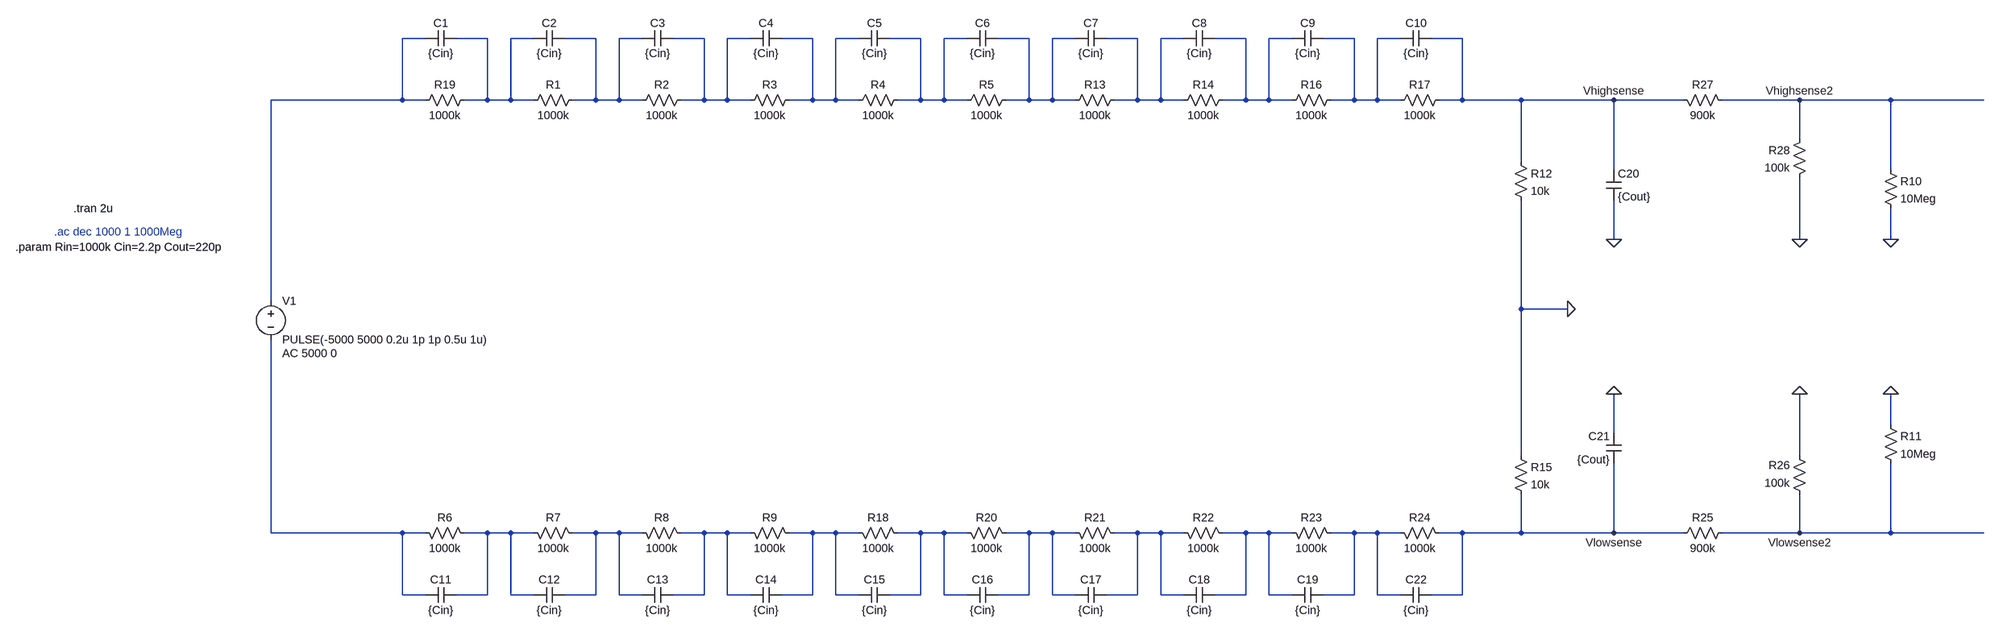
[diagram p0: schematic HVPSim.asc]
HVPSim.asc, the LTspice schematic file:
Version 4
SHEET 1 1996 816
WIRE -1616 -448 -1664 -448
WIRE -1488 -448 -1552 -448
WIRE -1392 -448 -1440 -448
WIRE -1264 -448 -1328 -448
WIRE -1168 -448 -1216 -448
WIRE -1040 -448 -1104 -448
WIRE -944 -448 -992 -448
WIRE -816 -448 -880 -448
WIRE -720 -448 -768 -448
WIRE -592 -448 -656 -448
WIRE -496 -448 -544 -448
WIRE -368 -448 -432 -448
WIRE -272 -448 -320 -448
WIRE -144 -448 -208 -448
WIRE -48 -448 -96 -448
WIRE 80 -448 16 -448
WIRE 176 -448 128 -448
WIRE 304 -448 240 -448
WIRE 400 -448 352 -448
WIRE 528 -448 464 -448
WIRE -1664 -320 -1664 -448
WIRE -1664 -320 -1936 -320
WIRE -1616 -320 -1664 -320
WIRE -1488 -320 -1488 -448
WIRE -1488 -320 -1536 -320
WIRE -1440 -320 -1440 -448
WIRE -1440 -320 -1488 -320
WIRE -1392 -320 -1440 -320
WIRE -1264 -320 -1264 -448
WIRE -1264 -320 -1312 -320
WIRE -1216 -320 -1216 -448
WIRE -1216 -320 -1264 -320
WIRE -1168 -320 -1216 -320
WIRE -1040 -320 -1040 -448
WIRE -1040 -320 -1088 -320
WIRE -992 -320 -992 -448
WIRE -992 -320 -1040 -320
WIRE -944 -320 -992 -320
WIRE -816 -320 -816 -448
WIRE -816 -320 -864 -320
WIRE -768 -320 -768 -448
WIRE -768 -320 -816 -320
WIRE -720 -320 -768 -320
WIRE -592 -320 -592 -448
WIRE -592 -320 -640 -320
WIRE -544 -320 -544 -448
WIRE -544 -320 -592 -320
WIRE -496 -320 -544 -320
WIRE -368 -320 -368 -448
WIRE -368 -320 -416 -320
WIRE -320 -320 -320 -448
WIRE -320 -320 -368 -320
WIRE -272 -320 -320 -320
WIRE -144 -320 -144 -448
WIRE -144 -320 -192 -320
WIRE -96 -320 -96 -448
WIRE -96 -320 -144 -320
WIRE -48 -320 -96 -320
WIRE 80 -320 80 -448
WIRE 80 -320 32 -320
WIRE 128 -320 128 -448
WIRE 128 -320 80 -320
WIRE 176 -320 128 -320
WIRE 304 -320 304 -448
WIRE 304 -320 256 -320
WIRE 352 -320 352 -448
WIRE 352 -320 304 -320
WIRE 400 -320 352 -320
WIRE 528 -320 528 -448
WIRE 528 -320 480 -320
WIRE 864 -320 528 -320
WIRE 1056 -320 864 -320
WIRE 1200 -320 1056 -320
WIRE 1440 -320 1280 -320
WIRE 1712 -320 1440 -320
WIRE 1904 -320 1712 -320
WIRE 1440 -240 1440 -320
WIRE 864 -192 864 -320
WIRE 1056 -176 1056 -320
WIRE 1712 -176 1712 -320
WIRE 1056 -32 1056 -112
WIRE 1440 -32 1440 -160
WIRE 1712 -32 1712 -96
WIRE -1936 96 -1936 -320
WIRE 864 112 864 -112
WIRE 960 112 864 112
WIRE 1712 352 1712 288
WIRE 1056 368 1056 288
WIRE 864 416 864 112
WIRE 1440 416 1440 288
WIRE -1936 576 -1936 176
WIRE -1664 576 -1936 576
WIRE -1616 576 -1664 576
WIRE -1488 576 -1536 576
WIRE -1440 576 -1488 576
WIRE -1392 576 -1440 576
WIRE -1264 576 -1312 576
WIRE -1216 576 -1264 576
WIRE -1168 576 -1216 576
WIRE -1040 576 -1088 576
WIRE -992 576 -1040 576
WIRE -944 576 -992 576
WIRE -816 576 -864 576
WIRE -768 576 -816 576
WIRE -720 576 -768 576
WIRE -592 576 -640 576
WIRE -544 576 -592 576
WIRE -496 576 -544 576
WIRE -368 576 -416 576
WIRE -320 576 -368 576
WIRE -272 576 -320 576
WIRE -144 576 -192 576
WIRE -96 576 -144 576
WIRE -48 576 -96 576
WIRE 80 576 32 576
WIRE 128 576 80 576
WIRE 176 576 128 576
WIRE 304 576 256 576
WIRE 352 576 304 576
WIRE 400 576 352 576
WIRE 528 576 480 576
WIRE 864 576 864 496
WIRE 864 576 528 576
WIRE 1056 576 1056 432
WIRE 1056 576 864 576
WIRE 1200 576 1056 576
WIRE 1440 576 1440 496
WIRE 1440 576 1280 576
WIRE 1712 576 1712 432
WIRE 1712 576 1440 576
WIRE 1904 576 1712 576
WIRE -1664 704 -1664 576
WIRE -1616 704 -1664 704
WIRE -1488 704 -1488 576
WIRE -1488 704 -1552 704
WIRE -1440 704 -1440 576
WIRE -1392 704 -1440 704
WIRE -1264 704 -1264 576
WIRE -1264 704 -1328 704
WIRE -1216 704 -1216 576
WIRE -1168 704 -1216 704
WIRE -1040 704 -1040 576
WIRE -1040 704 -1104 704
WIRE -992 704 -992 576
WIRE -944 704 -992 704
WIRE -816 704 -816 576
WIRE -816 704 -880 704
WIRE -768 704 -768 576
WIRE -720 704 -768 704
WIRE -592 704 -592 576
WIRE -592 704 -656 704
WIRE -544 704 -544 576
WIRE -496 704 -544 704
WIRE -368 704 -368 576
WIRE -368 704 -432 704
WIRE -320 704 -320 576
WIRE -272 704 -320 704
WIRE -144 704 -144 576
WIRE -144 704 -208 704
WIRE -96 704 -96 576
WIRE -48 704 -96 704
WIRE 80 704 80 576
WIRE 80 704 16 704
WIRE 128 704 128 576
WIRE 176 704 128 704
WIRE 304 704 304 576
WIRE 304 704 240 704
WIRE 352 704 352 576
WIRE 400 704 352 704
WIRE 528 704 528 576
WIRE 528 704 464 704
FLAG 1712 -32 0
FLAG 1712 288 0
FLAG 960 112 0
FLAG 1056 -320 Vhighsense
FLAG 1056 -32 0
FLAG 1056 288 0
FLAG 1056 576 Vlowsense
FLAG 1440 288 0
FLAG 1440 -32 0
FLAG 1440 -320 Vhighsense2
FLAG 1440 576 Vlowsense2
SYMBOL voltage -1936 80 R0
WINDOW 123 24 124 Left 2
WINDOW 39 0 0 Left 0
SYMATTR Value2 AC 5000 0
SYMATTR InstName V1
SYMATTR Value PULSE(-5000 5000 0.2u 1p 1p 0.5u 1u)
SYMBOL res 1696 -192 R0
SYMATTR InstName R10
SYMATTR Value 10Meg
SYMBOL res 1696 336 R0
SYMATTR InstName R11
SYMATTR Value 10Meg
SYMBOL res 848 -208 R0
SYMATTR InstName R12
SYMATTR Value 10k
SYMBOL res 848 400 R0
SYMATTR InstName R15
SYMATTR Value 10k
SYMBOL res -1520 -336 R90
WINDOW 0 0 56 VBottom 2
WINDOW 3 32 56 VTop 2
SYMATTR InstName R19
SYMATTR Value 1000k
SYMBOL cap 1040 -176 R0
SYMATTR InstName C20
SYMATTR Value {Cout}
SYMBOL cap 1072 432 R180
WINDOW 0 24 56 Left 2
WINDOW 3 24 8 Left 2
SYMATTR InstName C21
SYMATTR Value {Cout}
SYMBOL cap -1552 -464 R90
WINDOW 0 0 32 VBottom 2
WINDOW 3 32 32 VTop 2
SYMATTR InstName C1
SYMATTR Value {Cin}
SYMBOL res -1296 -336 R90
WINDOW 0 0 56 VBottom 2
WINDOW 3 32 56 VTop 2
SYMATTR InstName R1
SYMATTR Value 1000k
SYMBOL cap -1328 -464 R90
WINDOW 0 0 32 VBottom 2
WINDOW 3 32 32 VTop 2
SYMATTR InstName C2
SYMATTR Value {Cin}
SYMBOL res -1072 -336 R90
WINDOW 0 0 56 VBottom 2
WINDOW 3 32 56 VTop 2
SYMATTR InstName R2
SYMATTR Value 1000k
SYMBOL cap -1104 -464 R90
WINDOW 0 0 32 VBottom 2
WINDOW 3 32 32 VTop 2
SYMATTR InstName C3
SYMATTR Value {Cin}
SYMBOL res -848 -336 R90
WINDOW 0 0 56 VBottom 2
WINDOW 3 32 56 VTop 2
SYMATTR InstName R3
SYMATTR Value 1000k
SYMBOL cap -880 -464 R90
WINDOW 0 0 32 VBottom 2
WINDOW 3 32 32 VTop 2
SYMATTR InstName C4
SYMATTR Value {Cin}
SYMBOL res -624 -336 R90
WINDOW 0 0 56 VBottom 2
WINDOW 3 32 56 VTop 2
SYMATTR InstName R4
SYMATTR Value 1000k
SYMBOL cap -656 -464 R90
WINDOW 0 0 32 VBottom 2
WINDOW 3 32 32 VTop 2
SYMATTR InstName C5
SYMATTR Value {Cin}
SYMBOL res -400 -336 R90
WINDOW 0 0 56 VBottom 2
WINDOW 3 32 56 VTop 2
SYMATTR InstName R5
SYMATTR Value 1000k
SYMBOL cap -432 -464 R90
WINDOW 0 0 32 VBottom 2
WINDOW 3 32 32 VTop 2
SYMATTR InstName C6
SYMATTR Value {Cin}
SYMBOL res -176 -336 R90
WINDOW 0 0 56 VBottom 2
WINDOW 3 32 56 VTop 2
SYMATTR InstName R13
SYMATTR Value 1000k
SYMBOL cap -208 -464 R90
WINDOW 0 0 32 VBottom 2
WINDOW 3 32 32 VTop 2
SYMATTR InstName C7
SYMATTR Value {Cin}
SYMBOL res 48 -336 R90
WINDOW 0 0 56 VBottom 2
WINDOW 3 32 56 VTop 2
SYMATTR InstName R14
SYMATTR Value 1000k
SYMBOL cap 16 -464 R90
WINDOW 0 0 32 VBottom 2
WINDOW 3 32 32 VTop 2
SYMATTR InstName C8
SYMATTR Value {Cin}
SYMBOL res 272 -336 R90
WINDOW 0 0 56 VBottom 2
WINDOW 3 32 56 VTop 2
SYMATTR InstName R16
SYMATTR Value 1000k
SYMBOL cap 240 -464 R90
WINDOW 0 0 32 VBottom 2
WINDOW 3 32 32 VTop 2
SYMATTR InstName C9
SYMATTR Value {Cin}
SYMBOL res 496 -336 R90
WINDOW 0 0 56 VBottom 2
WINDOW 3 32 56 VTop 2
SYMATTR InstName R17
SYMATTR Value 1000k
SYMBOL cap 464 -464 R90
WINDOW 0 0 32 VBottom 2
WINDOW 3 32 32 VTop 2
SYMATTR InstName C10
SYMATTR Value {Cin}
SYMBOL res -1520 592 M270
WINDOW 0 32 56 VTop 2
WINDOW 3 0 56 VBottom 2
SYMATTR InstName R6
SYMATTR Value 1000k
SYMBOL cap -1552 720 M270
WINDOW 0 32 32 VTop 2
WINDOW 3 0 32 VBottom 2
SYMATTR InstName C11
SYMATTR Value {Cin}
SYMBOL res -1296 592 M270
WINDOW 0 32 56 VTop 2
WINDOW 3 0 56 VBottom 2
SYMATTR InstName R7
SYMATTR Value 1000k
SYMBOL cap -1328 720 M270
WINDOW 0 32 32 VTop 2
WINDOW 3 0 32 VBottom 2
SYMATTR InstName C12
SYMATTR Value {Cin}
SYMBOL res -1072 592 M270
WINDOW 0 32 56 VTop 2
WINDOW 3 0 56 VBottom 2
SYMATTR InstName R8
SYMATTR Value 1000k
SYMBOL cap -1104 720 M270
WINDOW 0 32 32 VTop 2
WINDOW 3 0 32 VBottom 2
SYMATTR InstName C13
SYMATTR Value {Cin}
SYMBOL res -848 592 M270
WINDOW 0 32 56 VTop 2
WINDOW 3 0 56 VBottom 2
SYMATTR InstName R9
SYMATTR Value 1000k
SYMBOL cap -880 720 M270
WINDOW 0 32 32 VTop 2
WINDOW 3 0 32 VBottom 2
SYMATTR InstName C14
SYMATTR Value {Cin}
SYMBOL res -624 592 M270
WINDOW 0 32 56 VTop 2
WINDOW 3 0 56 VBottom 2
SYMATTR InstName R18
SYMATTR Value 1000k
SYMBOL cap -656 720 M270
WINDOW 0 32 32 VTop 2
WINDOW 3 0 32 VBottom 2
SYMATTR InstName C15
SYMATTR Value {Cin}
SYMBOL res -400 592 M270
WINDOW 0 32 56 VTop 2
WINDOW 3 0 56 VBottom 2
SYMATTR InstName R20
SYMATTR Value 1000k
SYMBOL cap -432 720 M270
WINDOW 0 32 32 VTop 2
WINDOW 3 0 32 VBottom 2
SYMATTR InstName C16
SYMATTR Value {Cin}
SYMBOL res -176 592 M270
WINDOW 0 32 56 VTop 2
WINDOW 3 0 56 VBottom 2
SYMATTR InstName R21
SYMATTR Value 1000k
SYMBOL cap -208 720 M270
WINDOW 0 32 32 VTop 2
WINDOW 3 0 32 VBottom 2
SYMATTR InstName C17
SYMATTR Value {Cin}
SYMBOL res 48 592 M270
WINDOW 0 32 56 VTop 2
WINDOW 3 0 56 VBottom 2
SYMATTR InstName R22
SYMATTR Value 1000k
SYMBOL cap 16 720 M270
WINDOW 0 32 32 VTop 2
WINDOW 3 0 32 VBottom 2
SYMATTR InstName C18
SYMATTR Value {Cin}
SYMBOL res 272 592 M270
WINDOW 0 32 56 VTop 2
WINDOW 3 0 56 VBottom 2
SYMATTR InstName R23
SYMATTR Value 1000k
SYMBOL cap 240 720 M270
WINDOW 0 32 32 VTop 2
WINDOW 3 0 32 VBottom 2
SYMATTR InstName C19
SYMATTR Value {Cin}
SYMBOL res 496 592 M270
WINDOW 0 32 56 VTop 2
WINDOW 3 0 56 VBottom 2
SYMATTR InstName R24
SYMATTR Value 1000k
SYMBOL cap 464 720 M270
WINDOW 0 32 32 VTop 2
WINDOW 3 0 32 VBottom 2
SYMATTR InstName C22
SYMATTR Value {Cin}
SYMBOL res 1296 560 R90
WINDOW 0 0 56 VBottom 2
WINDOW 3 32 56 VTop 2
SYMATTR InstName R25
SYMATTR Value 900k
SYMBOL res 1456 512 R180
WINDOW 0 36 76 Left 2
WINDOW 3 36 40 Left 2
SYMATTR InstName R26
SYMATTR Value 100k
SYMBOL res 1296 -304 M270
WINDOW 0 32 56 VTop 2
WINDOW 3 0 56 VBottom 2
SYMATTR InstName R27
SYMATTR Value 900k
SYMBOL res 1456 -256 M0
SYMATTR InstName R28
SYMATTR Value 100k
TEXT -2344 -96 Left 2 !.tran 2u
TEXT -2384 -48 Left 2 ;.ac dec 1000 1 1000Meg
TEXT -2464 -16 Left 2 !.param Rin=1000k Cin=2.2p Cout=220p

The netlist it stands for:
* HVPSim.asc
V1 N001 N011 PULSE(-5000 5000 0.2u 1p 1p 0.5u 1u) AC 5000 0
R10 Vhighsense2 0 10Meg
R11 0 Vlowsense2 10Meg
R12 Vhighsense 0 10k
R15 0 Vlowsense 10k
R19 N002 N001 1000k
C20 Vhighsense 0 {Cout}
C21 Vlowsense 0 {Cout}
C1 N002 N001 {Cin}
R1 N003 N002 1000k
C2 N003 N002 {Cin}
R2 N004 N003 1000k
C3 N004 N003 {Cin}
R3 N005 N004 1000k
C4 N005 N004 {Cin}
R4 N006 N005 1000k
C5 N006 N005 {Cin}
R5 N007 N006 1000k
C6 N007 N006 {Cin}
R13 N008 N007 1000k
C7 N008 N007 {Cin}
R14 N009 N008 1000k
C8 N009 N008 {Cin}
R16 N010 N009 1000k
C9 N010 N009 {Cin}
R17 Vhighsense N010 1000k
C10 Vhighsense N010 {Cin}
R6 N012 N011 1000k
C11 N012 N011 {Cin}
R7 N013 N012 1000k
C12 N013 N012 {Cin}
R8 N014 N013 1000k
C13 N014 N013 {Cin}
R9 N015 N014 1000k
C14 N015 N014 {Cin}
R18 N016 N015 1000k
C15 N016 N015 {Cin}
R20 N017 N016 1000k
C16 N017 N016 {Cin}
R21 N018 N017 1000k
C17 N018 N017 {Cin}
R22 N019 N018 1000k
C18 N019 N018 {Cin}
R23 N020 N019 1000k
C19 N020 N019 {Cin}
R24 Vlowsense N020 1000k
C22 Vlowsense N020 {Cin}
R25 Vlowsense2 Vlowsense 900k
R26 Vlowsense2 0 100k
R27 Vhighsense2 Vhighsense 900k
R28 Vhighsense2 0 100k
.tran 2u
* .ac dec 1000 1 1000Meg
.param Rin=1000k Cin=2.2p Cout=220p
.backanno
.end